# Altium schematic sheet Power.SchDoc
size A3; DocumentNumber: 1; Revision: V1.0; SheetNumber: 1; SheetTotal: 3
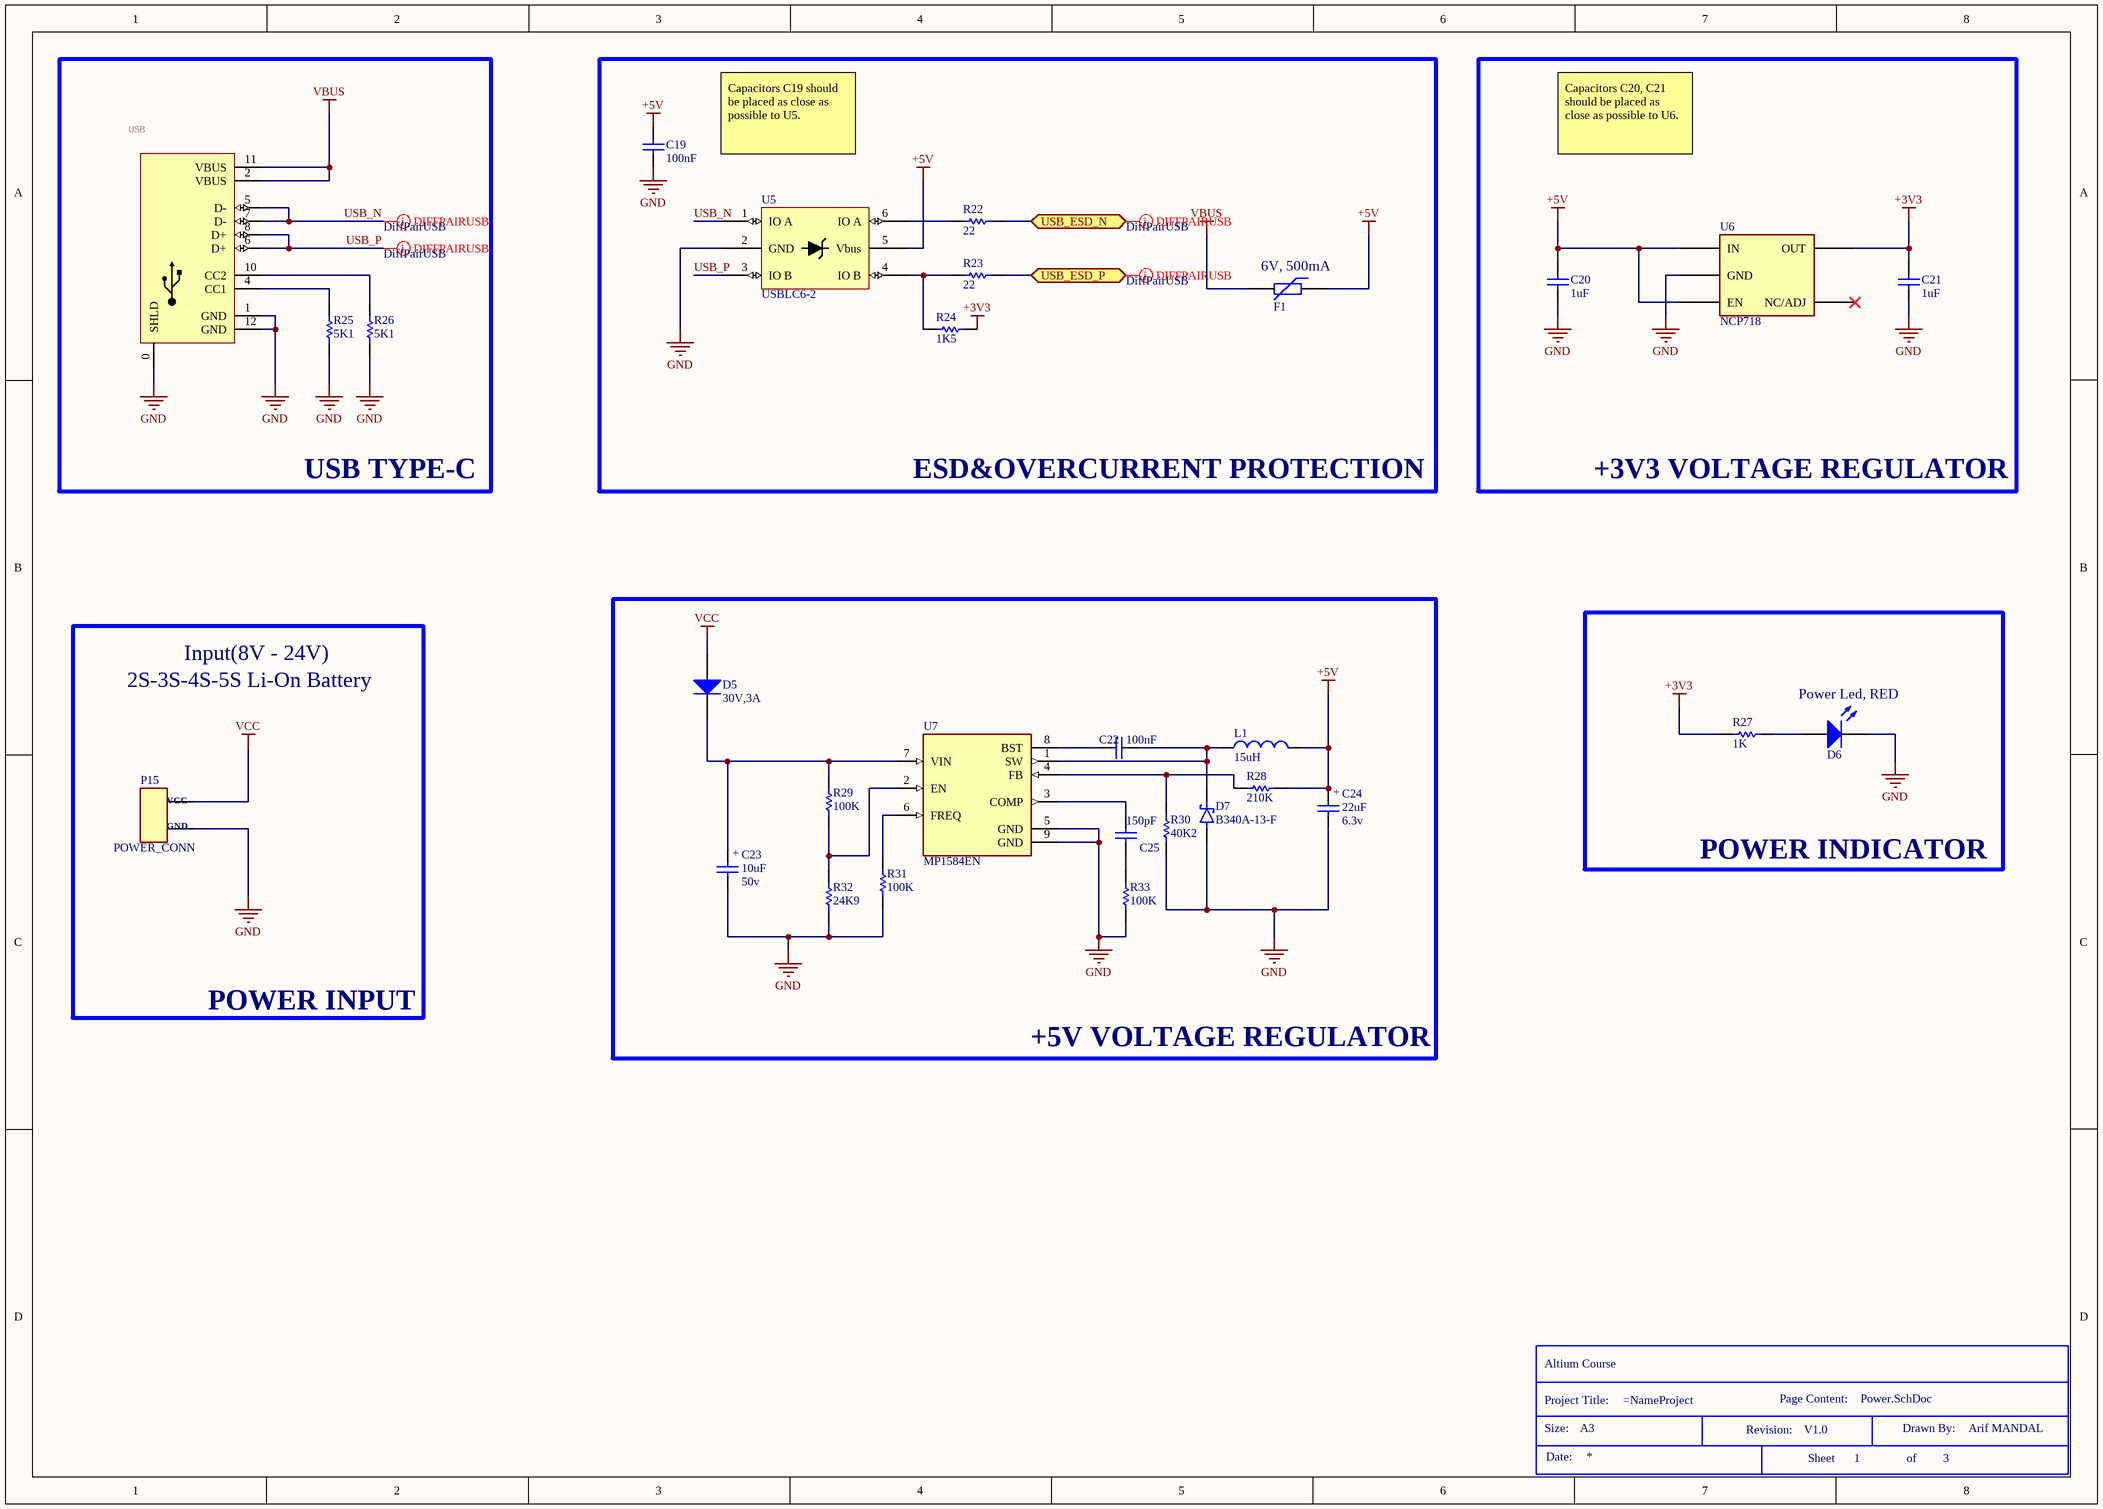
[diagram p0: Power.SchDoc]

## Parts
*  Size: A3  Drawn By: Arif MANDAL  (hidden comment: Title Block)  (graphical)
C19  100nF  [C805]
C20  1uF  [C805]
C21  1uF  [C805]
C22  100nF  [C805]
C23  Volte: 50v  [MY_SMC_A]  (hidden comment: 10uF)
C24  Volte: 6.3v  [MY_SMC_A]  (hidden comment: 22uF)
C25  150pF  [C805]
D5  30V,3A  [MY_1N4007_SMD]
D6  LED  [LED-1206]  (value not drawn)
D7  B340A-13-F  [DIOM5226X240N]
F1  500mA  [PTC-0805]  (value not drawn)
L1  15uH  [MY_DR73]
P15  POWER_CONN  [POWER_CONN]
R22  22  [R805]
R23  22  [R805]
R24  1K5  [R805]
R25  5K1  [R805]
R26  5K1  [R805]
R27  1K  [R805]
R28  210K  [R805]
R29  100K  [R805]
R30  40K2  [R805]
R31  100K  [R805]
R32  24K9  [R805]
R33  100K  [R805]
U5  USBLC6-2  [SOT-23-6]
U6  NCP718  [TSOT-23-5]
U7  MP1584EN  [SOIC127P-9N]
USB  USB_C  [USB-C-5]  (value not drawn)

## Blocks framed on the sheet
USB TYPE-C: R25 R26 USB
ESD&OVERCURRENT PROTECTION: C19 F1 R22-R24 U5
+3V3 VOLTAGE REGULATOR: C20 C21 U6
+5V VOLTAGE REGULATOR: C22-C25 D5 D7 L1 R28-R33 U7
POWER INPUT: P15
POWER INDICATOR: D6 R27

## Ports
USB_ESD_N (bidir), USB_ESD_P (bidir)

## Nets
+3V3: C21.2 R24.2 R27.1 U6.5(OUT)
+5V: C19.2 C20.2 C24.+ F1.1 L1.2 R28.1 U5.5(Vbus) U6.1(IN) U6.3(EN)
GND: C19.1 C20.1 C21.1 C23.- C24.- D6.2(K) D7.A P15.1(GND) R25.1 R26.1 R30.2 R31.1 R32.1 R33.1 U5.2(GND) U6.2(GND) U7.5(GND) U7.9(GND) USB.0(SHLD) USB.1(GND) USB.12(GND)
VBUS: F1.2 USB.2(VBUS) USB.11(VBUS)
VCC: D5.A P15.0(VCC)
USB_ESD_N: R22.1 ; port USB_ESD_N
USB_ESD_P: R23.1 ; port USB_ESD_P
USB_N: U5.1(IO_A) USB.5(D-) USB.7(D-)
USB_P: U5.3(IO_B) USB.6(D+) USB.8(D+)
NetC22_1: C22.1 D7.C L1.1 U7.1(SW)
NetC22_2: C22.2 U7.8(BST)
NetC23_+: C23.+ D5.K R29.2 U7.7(VIN)
NetC25_1: C25.1 R33.2
NetC25_2: C25.2 U7.3(COMP)
NetD6_1: D6.1(A) R27.2
NetR22_2: R22.2 U5.6(IO_A)
NetR23_2: R23.2 R24.1 U5.4(IO_B)
NetR25_2: R25.2 USB.4(CC1)
NetR26_2: R26.2 USB.10(CC2)
NetR28_2: R28.2 R30.1 U7.4(FB)
NetR29_1: R29.1 R32.2 U7.2(EN)
NetR31_2: R31.2 U7.6(FREQ)

Not connected (* = marked no-connect by the designer): U6 4(NC/ADJ)*

## Layout directives
differential pair; differential pair class DiffPairUSB: USB_ESD_N, USB_ESD_P, USB_N, USB_P

## Notes on the sheet
- Capacitors C19 should be placed as close as possible to U5.
- Capacitors C20, C21 should be placed as close as possible to U6.
- (near F1) 6V, 500mA
- 2S-3S-4S-5S Li-On Battery
- Input(8V - 24V)
- Power Led, RED
- (in symbol Title Block) Altium Course; Project Title:; Page Content:; Size:; Revision:; Drawn By:; Date:; Sheet; of

## Library data of the parts
C19-C22 C25 = Cap: Capacitor; Designer: Parsa Malekpour
  C19 C22: Value: 100nF
  C20 C21: Value: 1uF
  C25: Value: 150pF
C23 C24 = Cap Pol: Polar capacitor; ASiD Part Number: C-AS
  C23: Value: 10uF
  C24: Value: 22uF
D5 = 1N4007: 1 Amp Diode; ASiD Part Number: 1n4007-AS
D7 = B340A-13-F: Diode, Rectifier, 3a, 40v, Do-214ac, Full Reel; Price: None; Value: *; MP: B340A-13-F; Package: None; Availability: Unavailable
F1 = PTC: Published: 24-Mar-1999; PackageVersion: Mar-2003; PackageReference: 6-0805
L1 = Inductor: ASiD Part Number: Inductor-AS; Current: 3.75A; Value: 15uH
P15 = POWER_CONN: Li-on Battery Power Connector
R22-R33 = Resistor: Designer: Parsa Malekpour
  R22 R23: Value: 22
  R24: Value: 1K5
  R25 R26: Value: 5K1
  R27: Value: 1K
  R28: Value: 210K
  R29 R31 R33: Value: 100K
  R30: Value: 40K2
  R32: Value: 24K9
U5 = USBLC6-2: Very low capacitance ESD protection
U6 = NCP718: Linear Voltage Regulator IC Positive Fixed 1 Output 300mA TSOT-23-5; Manu. Product Num.: NCP718BSN330T1G
U7 = MP1584EN: Buck Switching Regulator IC Positive Adjustable 0.8V 1 Output 3A 8-SOIC (0.154, 3.90mm Width) Exposed Pad; MF: Monolithic Power; Value: *; SnapEDA_Link: https://www.snapeda.com/parts/MP1584EN/Monolithic+Power+Systems+Inc./view-part/?ref=snap; MP: MP1584EN; Purchase-URL: https://pricing.snapeda.com/search/part/MP1584EN/?ref=eda; Check_prices: https://www.snapeda.com/parts/MP1584EN/Monolithic+Power+Systems+Inc./view-part/?ref=eda; Availability: In Stock; Price: None; Package: SOIC-8 Monolithic Power
USB = USB_C: USB Type C 16Pin Connector Super Speed pins not available on the 16-pin purely SMD connector so this part is best for USB 2.0 implementations. D1 and D2 are tied together enabling D+/- no matter which way the cable is plugged into the connector. The two channel configuration pins (CC1/2) are exposed. These are normally connected to ground via 5.1k resistors but can be reconfigured for high current/high power applications.; GateName_1: J1; SymbolName_1: USB-C-MINIMUM; DeviceName: 5; LibraryName: USBC; DeviceSetName: USB_C